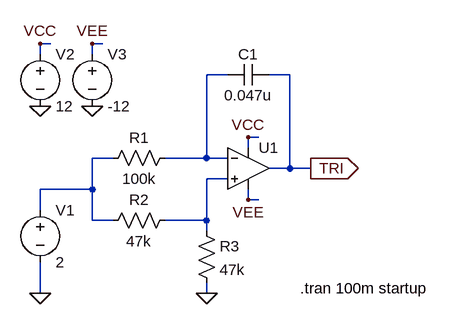
[diagram p0: schematic Integrator_Q1_Off.asc]
Integrator_Q1_Off.asc, the LTspice schematic file:
Version 4
SHEET 1 880 680
WIRE -96 -48 -112 -48
WIRE -16 -48 -32 -48
WIRE -112 -32 -112 -48
WIRE -32 -32 -32 -48
WIRE 176 0 144 0
WIRE 272 0 240 0
WIRE 224 96 208 96
WIRE 208 112 208 96
WIRE 0 128 -32 128
WIRE 144 128 144 0
WIRE 144 128 80 128
WIRE 176 128 144 128
WIRE 272 144 272 0
WIRE 272 144 240 144
WIRE 304 144 272 144
WIRE 176 160 144 160
WIRE -32 176 -32 128
WIRE -32 176 -112 176
WIRE 208 192 208 176
WIRE 224 192 208 192
WIRE -112 208 -112 176
WIRE -32 224 -32 176
WIRE 0 224 -32 224
WIRE 144 224 144 160
WIRE 144 224 80 224
WIRE 144 240 144 224
WIRE -112 336 -112 288
WIRE 144 336 144 320
FLAG 208 96 VCC
FLAG 208 192 VEE
FLAG 144 336 0
FLAG 304 144 TRI
IOPIN 304 144 Out
FLAG -112 336 0
FLAG -112 48 0
FLAG -32 48 0
FLAG -112 -48 VCC
FLAG -32 -48 VEE
SYMBOL Opamps\\UniversalOpamp2 208 144 R0
SYMATTR InstName U1
SYMBOL res 96 112 R90
WINDOW 0 0 56 VBottom 2
WINDOW 3 32 56 VTop 2
SYMATTR InstName R1
SYMATTR Value 100k
SYMBOL res 96 208 R90
WINDOW 0 0 56 VBottom 2
WINDOW 3 32 56 VTop 2
SYMATTR InstName R2
SYMATTR Value 47k
SYMBOL res 128 224 R0
SYMATTR InstName R3
SYMATTR Value 47k
SYMBOL cap 240 -16 R90
WINDOW 0 0 32 VBottom 2
WINDOW 3 32 32 VTop 2
SYMATTR InstName C1
SYMATTR Value 0.047u
SYMBOL voltage -112 192 R0
SYMATTR InstName V1
SYMATTR Value 2
SYMBOL voltage -112 -48 R0
WINDOW 123 0 0 Left 2
WINDOW 39 0 0 Left 2
SYMATTR InstName V2
SYMATTR Value 12
SYMBOL voltage -32 -48 R0
WINDOW 123 0 0 Left 2
WINDOW 39 0 0 Left 2
SYMATTR InstName V3
SYMATTR Value -12
TEXT 288 328 Left 2 !.tran 100m startup

The netlist it stands for:
* Integrator_Q1_Off.asc
XU1 N003 N001 VCC VEE TRI level.2 Avol=1Meg GBW=10Meg Slew=10Meg ilimit=25m rail=0 Vos=0 phimargin=45 en=0 enk=0 in=0 ink=0 Rin=500Meg  ; pins IN+ IN- V+ V- OUT
R1 N001 N002 100k
R2 N003 N002 47k
R3 N003 0 47k
C1 TRI N001 0.047u
V1 N002 0 2
V2 VCC 0 12
V3 VEE 0 -12
.tran 100m startup
.lib UniversalOpamps2.sub
.backanno
.end